# EAGLE design SatNOGSBoard_100mm_80mm (EAGLE 7.2.0)
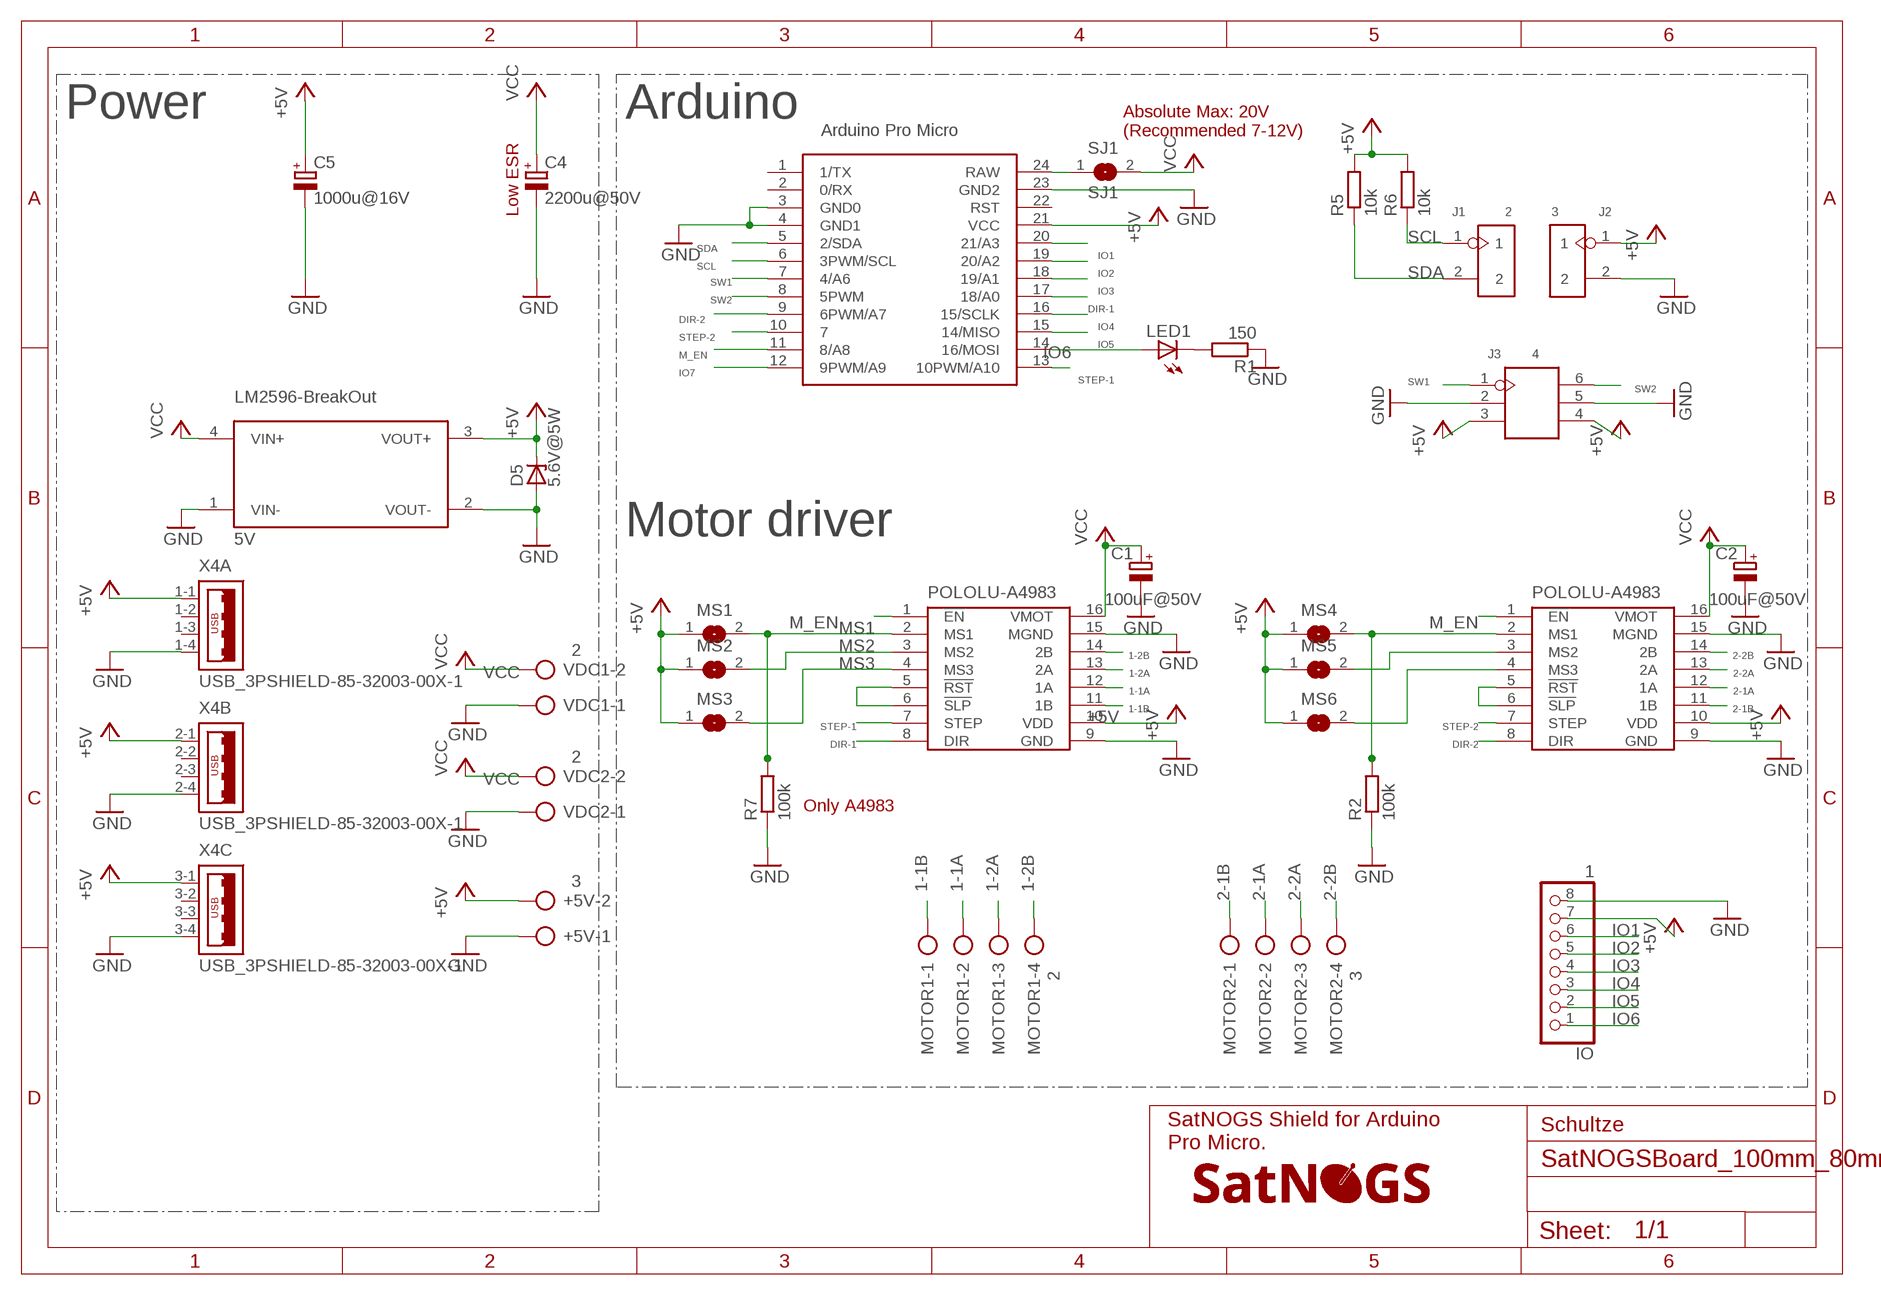
[diagram p0: schematic, sheet 1]

## Parts
+5V  3  AK500/2  [AK500/2]
AZIMUTH  POLOLU-A4983/A4988"  [POLOLU-A4983]
C1  100uF@50V  CPOL-EUE2.5-6  [E2,5-6]
C2  100uF@50V  CPOL-EUE2.5-6  [E2,5-6]
C4  2200u@50V  CPOL-EUE7.5-16  [E7,5-16]
C5  1000u@16V  CPOL-EUE3.5-8  [E3,5-8]
D5  5.6V@5W  ZENER-DIODEDO41Z10  [DO41Z10]
ELEVATION  POLOLU-A4983/A4988"  [POLOLU-A4983]
IO  1  PINHD-1X8  [1X08]
J1  2  HEADER-2P-65/35MIL  [2P-2.54-65/35MIL]
J2  3  HEADER-2P-65/35MIL  [2P-2.54-65/35MIL]
J3  4  HEADER-2X3P-2.54  [2X3P-2.54-65/35MIL]
LED1  LED3MM  [LED3MM]
LM2596  5V  LM2596-BREAKOUTLM2596-BREAKOUT  [LM2596-BREAKOUT]
MOTOR1  2  AK500/4  [AK500/4]
MOTOR2  3  AK500/4  [AK500/4]
MS1  SJ1  SJ  [SJ]
MS2  SJ1  SJ  [SJ]
MS3  SJ1  SJ  [SJ]
MS4  SJ1  SJ  [SJ]
MS5  SJ1  SJ  [SJ]
MS6  SJ1  SJ  [SJ]
R1  150  R-EU_R0805  [R0805]
R2  100k  R-EU_R0805  [R0805]
R5  10k  R-EU_R0805  [R0805]
R6  10k  R-EU_R0805  [R0805]
R7  100k  R-EU_R0805  [R0805]
SJ1  SJ1  SJ  [SJ]
U$1  SATNOGS_LOGOCOPPER_M  [LOGO_COPPER_M]
UC  ARDUINO_PRO_MICROARDUINO_BOARD  [ARDUINO_MICRO_PRO]
VDC1  2  AK500/2  [AK500/2]
VDC2  2  AK500/2  [AK500/2]
X4  USB_3PSHIELD-85-32003-00X-1  [85-32003-00X-1]

## Nets
1-1A [power]: AZIMUTH.12(1A) MOTOR1.2
1-1B [power]: AZIMUTH.11(1B) MOTOR1.1
1-2A [power]: AZIMUTH.13(2A) MOTOR1.3
1-2B [power]: AZIMUTH.14(2B) MOTOR1.4
2-1A [power]: ELEVATION.12(1A) MOTOR2.2
2-1B [power]: ELEVATION.11(1B) MOTOR2.1
2-2A [power]: ELEVATION.13(2A) MOTOR2.3
2-2B [power]: ELEVATION.14(2B) MOTOR2.4
+5V: +5V.2 AZIMUTH.10(VDD) C5.+ D5.C ELEVATION.10(VDD) IO.7 J2.1 J3.3 J3.4 LM2596.3(VOUT+) MS1.1 MS2.1 MS3.1 MS4.1 MS5.1 MS6.1 R5.2 R6.2 UC.21(VCC) X4.1-1 X4.2-1 X4.3-1
DIR-1: AZIMUTH.8(DIR) UC.17(18/A0)
DIR-2: ELEVATION.8(DIR) UC.9(6PWM/A7)
GND: +5V.1 AZIMUTH.9(GND) AZIMUTH.15(MGND) C1.- C2.- C4.- C5.- D5.A ELEVATION.9(GND) ELEVATION.15(MGND) IO.8 J2.2 J3.2 J3.5 LM2596.1(VIN-) LM2596.2(VOUT-) R1.1 R2.1 R7.1 UC.3(GND0) UC.4(GND1) UC.23(GND2) VDC1.1 VDC2.1 X4.1-4 X4.2-4 X4.3-4
IO1: IO.6 UC.20(21/A3)
IO2: IO.5 UC.19(20/A2)
IO3: IO.4 UC.18(19/A1)
IO4: IO.3 UC.16(15/SCLK)
IO5: IO.2 UC.15(14/MISO)
IO6: IO.1 LED1.A UC.14(16/MOSI)
IO7: UC.12(9PWM/A9)
M_EN: AZIMUTH.1(!EN) ELEVATION.1(!EN) UC.11(8/A8)
MS1: AZIMUTH.2(MS1) MS1.2 R7.2
MS2: AZIMUTH.3(MS2) MS2.2
MS3: AZIMUTH.4(MS3) MS3.2
MS4: ELEVATION.2(MS1) MS4.2 R2.2
MS5: ELEVATION.3(MS2) MS5.2
MS6: ELEVATION.4(MS3) MS6.2
N$1: AZIMUTH.5(!RST) AZIMUTH.6(!SLP)
N$2: ELEVATION.5(!RST) ELEVATION.6(!SLP)
N$3: SJ1.1 UC.24(RAW)
N$6: LED1.K(C) R1.2
SCL: J1.1 R6.1 UC.6(3PWM/SCL)
SDA: J1.2 R5.1 UC.5(2/SDA)
STEP-1: AZIMUTH.7(STEP) UC.13(10PWM/A10)
STEP-2: ELEVATION.7(STEP) UC.10
SW1: J3.1 UC.7(4/A6)
SW2: J3.6 UC.8(5PWM)
VCC [power]: AZIMUTH.16(VMOT) C1.+ C2.+ C4.+ ELEVATION.16(VMOT) LM2596.4(VIN+) SJ1.2 VDC1.2 VDC2.2
Unconnected: UC.1(1/TX) UC.2(0/RX) UC.22(RST) X4.1-2 X4.1-3 X4.2-2 X4.2-3 X4.3-2 X4.3-3 X4.M1(S:S1) X4.M2(S:S2) X4.M3(S:S3) X4.M4(S:S4)

## Notes on the sheet
- Power | Arduino
- Absolute Max: 20V
  (Recommended 7-12V)
- Low ESR
- Motor driver
- Only A4983
- Schultze
- SatNOGS Shield for Arduino
  Pro Micro.

## Library data of the parts
+5V VDC1 VDC2 = con-ptr500:AK500/2: CONNECTOR; OC_FARNELL: unknown; OC_NEWARK: unknown
AZIMUTH ELEVATION = satnogs:POLOLU-A4983/A4988: Stepper motor driver https://www.pololu.com/product/1182
C1 C2 C4 C5 = rcl:CPOL-EU: POLARIZED CAPACITOR, European symbol
D5 = diode:ZENER-DIODE: Z-Diode; MPN: 1N5339B
IO = pinhead:PINHD-1X8: PIN HEADER
J1 J2 = Connector:HEADER-2P
J3 = Connector:HEADER-2X3P
LED1 = led:LED: LED OSRAM: - CHIPLED LG R971, LG N971, LY N971, LG Q971, LY Q971, LO R971, LY R971 LH N974, LH R974 LS Q976, LO Q976, LY Q976 LO Q996 - Hyper CHIPLED LW Q18S LB Q993, LB Q99A, LB R99A - SideLED LS A670, LO A670, LY A670, LG A670, LP A670 LB A673, LV A673, LT A673, LW A673 LH A674 LY A675 LS A676, LA A676, LO A676, LY A676, LW A676 LS A679, LY A679, LG A679 - Hyper Micro SIDELED® LS Y876, LA Y876, LO Y876, LY Y876 LT Y87S - SmartLED LW L88C, LW L88S LB L89C, LB L89S, LG L890 LS L89K, LO L89K, LY L89K LS L896, LA L896, LO L896, LY L896 - TOPLED LS T670, LO T670, LY T670, LG T670, LP T670 LSG T670, LSP T670, LSY T670, LOP T670, LYG T670 LG T671, LOG T671, LSG T671 LB T673, LV T673, LT T673, LW T673 LH T674 LS T676, LA T676, LO T676, LY T676, LB T676, LH T676, LSB T676, LW T676 LB T67C, LV T67C, LT T67C, LS T67K, LO T67K, LY T67K, LW E67C LS E67B, LA E67B, LO E67B, LY E67B, LB E67C, LV E67C, LT E67C LW T67C LS T679, LY T679, LG T679 LS T770, LO T770, LY T770, LG T770, LP T770 LB T773, LV T773, LT T773, LW T773 LH T774 LS E675, LA E675, LY E675, LS T675 LS T776, LA T776, LO T776, LY T776, LB T776 LHGB T686 LT T68C, LB T68C - Hyper Mini TOPLED® LB M676 - Mini TOPLED Santana® LG M470 LS M47K, LO M47K, LY M47K Source: http://www.osram.convergy.de LUXEON: - LUMILED® LXK2-PW12-R00, LXK2-PW12-S00, LXK2-PW14-U00, LXK2-PW14-V00 LXK2-PM12-R00, LXK2-PM12-S00, LXK2-PM14-U00 LXK2-PE12-Q00, LXK2-PE12-R00, LXK2-PE12-S00, LXK2-PE14-T00, LXK2-PE14-U00 LXK2-PB12-K00, LXK2-PB12-L00, LXK2-PB12-M00, LXK2-PB14-N00, LXK2-PB14-P00, LXK2-PB14-Q00 LXK2-PR12-L00, LXK2-PR12-M00, LXK2-PR14-Q00, LXK2-PR14-R00 LXK2-PD12-Q00, LXK2-PD12-R00, LXK2-PD12-S00 LXK2-PH12-R00, LXK2-PH12-S00 LXK2-PL12-P00, LXK2-PL12-Q00, LXK2-PL12-R00 Source: www.luxeon.com KINGBRIGHT: KA-3528ASYC Source: www.kingbright.com
LM2596 = satnogs:LM2596-BREAKOUT: Break out for LM2596 Switching power supply (regulated) Footprint approx. 41mmx21mm
MOTOR1 MOTOR2 = con-ptr500:AK500/4: CONNECTOR; OC_FARNELL: unknown; OC_NEWARK: unknown
MS1-MS6 SJ1 = jumper:SJ: SMD solder JUMPER
R1 R2 R5-R7 = rcl:R-EU_: RESISTOR, European symbol
U$1 = satnogs:SATNOGS_LOGO
UC = satnogs:ARDUINO_PRO_MICRO
X4 = con-cypressindustries:USB_3PSHIELD-: Triple USB Connector Source: www.cypressindustries.com; OC_FARNELL: unknown; OC_NEWARK: unknown

## Net classes
0 default: width 0.508 mm, drill 0.813 mm, clearance 0.254 mm
1 power: width 0.813 mm, drill 0.813 mm, clearance 0.254 mm

## Board
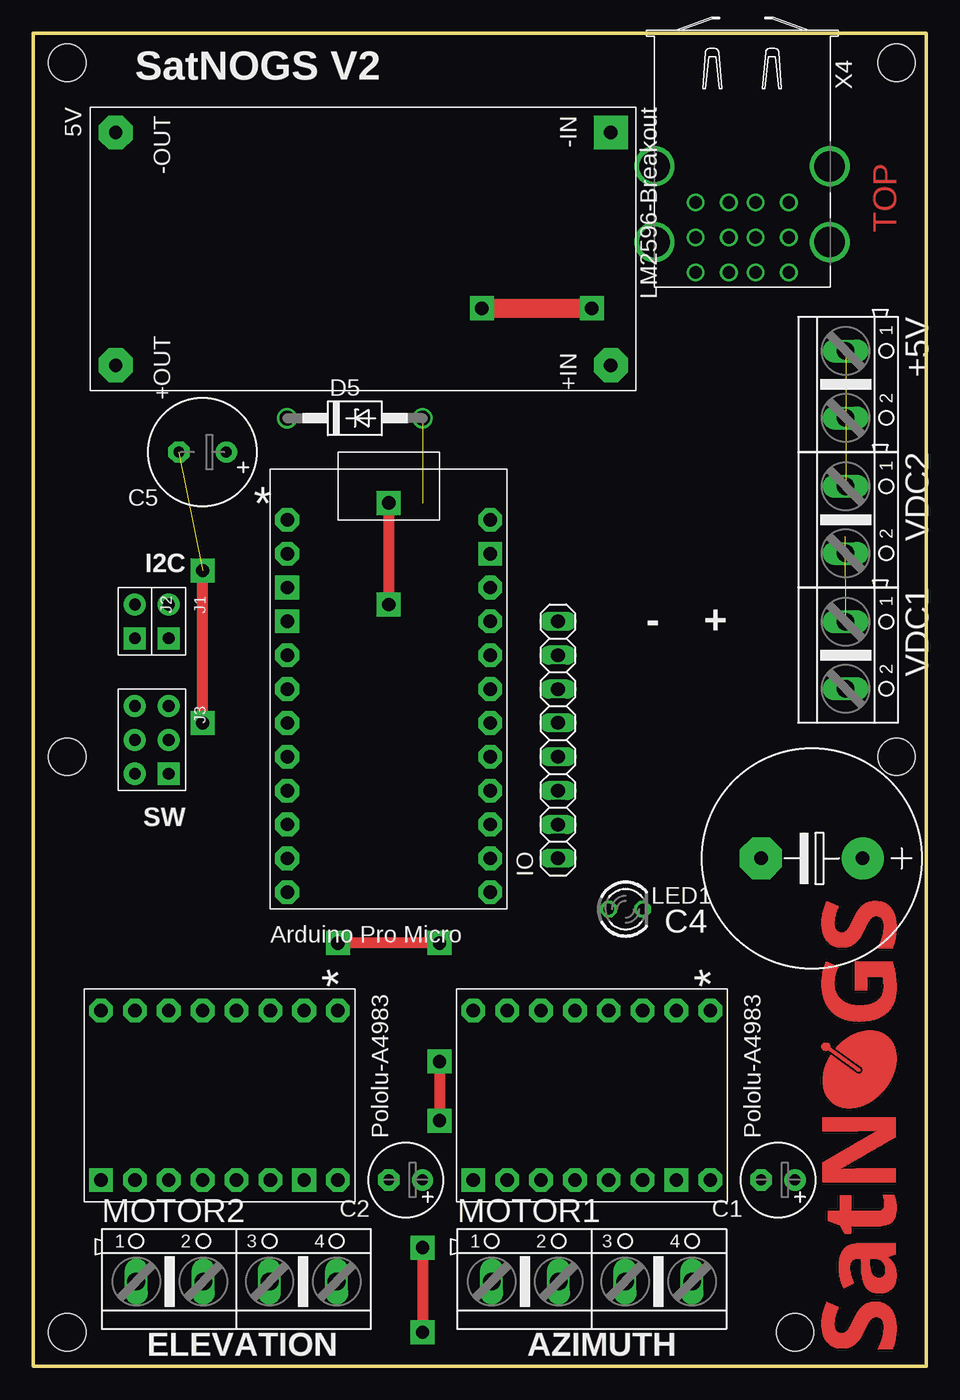
[diagram p1: board, top side]
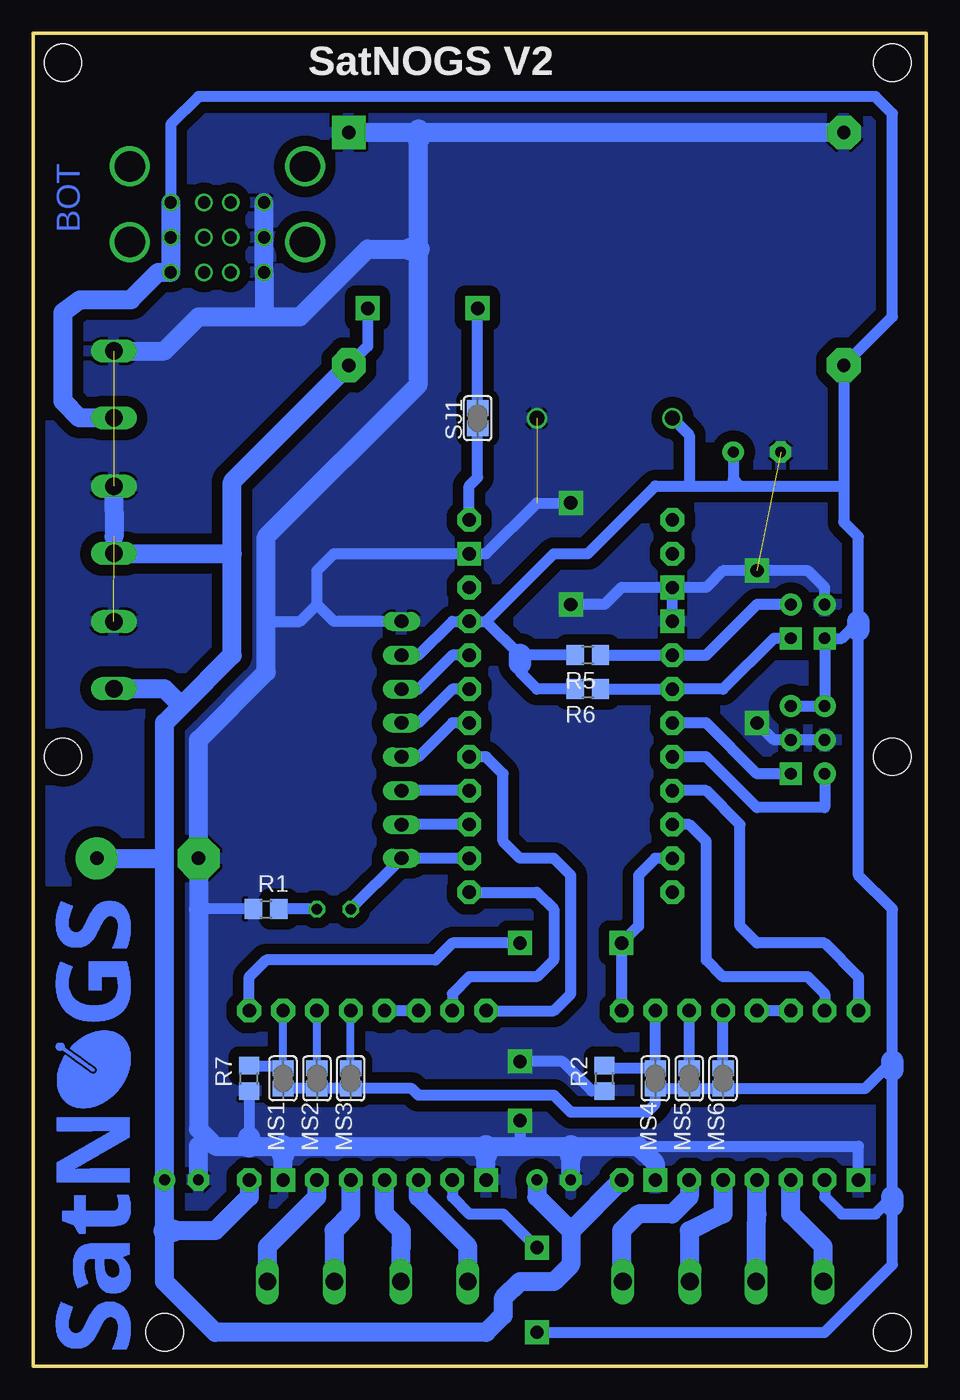
[diagram p2: board, bottom side, seen from below]

Size 67 x 100 mm. Coordinates in mm from the lower left corner, seen from the top.
Outline: 0,0 67,0 67,100 0,100 0,0
Copper layers (1*16): Top 0.035mm / dielectric 1.5mm / Bottom 0.035mm
Design rules "PCB-POOL Standard *": minimum track width 1mil, minimum drill 0.3mm, track to track 0.15mm, track to pad 0.15mm, pad to pad 0.15mm, via to via 0.15mm, smd to smd 0.15mm, copper to edge 0.3mm, drill to drill 0.2mm, minimum pad ring 0.2mm, minimum via ring 0.15mm, stop-mask expansion 0.075mm, vias tented up to drill 0mil, thermal gap 0.2mm
Holes 2.8 mm at 2.54,97.79 64.77,97.79 2.54,2.54 57.15,2.54 2.54,45.72 64.77,45.72

### Footprints (pad centres in the part's own frame; a part is rotated, then mirrored left to right if it is on the bottom)
AK500/2 = drill 1.321 long: 1 -2.515,0; 2 2.515,0
POLOLU-A4983 = drill 1 pad 1.778 octagon: 1 -6.35,8.89; 2 -6.35,6.35; 3 -6.35,3.81; 4 -6.35,1.27; 5 -6.35,-1.27; 6 -6.35,-3.81; 7 -6.35,-6.35; 8 -6.35,-8.89; 10 6.35,-6.35; 11 6.35,-3.81; 12 6.35,-1.27; 13 6.35,1.27; 14 6.35,3.81; 16 6.35,8.89 | drill 1 pad 1.778 square: 9 6.35,-8.89; 15 6.35,6.35
E2,5-6 = drill 0.813 pad 1.6: + -1.27,0 | drill 0.813 pad 1.6 octagon: - 1.27,0
E7,5-16 = drill 1.016 pad 3.15: + -3.81,0 | drill 1.016 pad 3.15 octagon: - 3.81,0
E3,5-8 = drill 0.813 pad 1.6: + -1.778,0 | drill 0.813 pad 1.6 octagon: - 1.778,0
DO41Z10 = drill 1.118: A 5.08,0; C -5.08,0
1X08 = drill 1.016 long: 1 -8.89,0; 2 -6.35,0; 3 -3.81,0; 4 -1.27,0; 5 1.27,0; 6 3.81,0; 7 6.35,0; 8 8.89,0
2P-2.54-65/35MIL = drill 0.889 pad 1.651 square: 1 0,1.27 | drill 0.889 pad 1.651: 2 0,-1.27
2X3P-2.54-65/35MIL = drill 0.889 pad 1.651 square: 1 -1.27,2.54 | drill 0.889 pad 1.651: 2 -1.27,0; 3 -1.27,-2.54; 4 1.27,-2.54; 5 1.27,0; 6 1.27,2.54
LED3MM = drill 0.813 octagon: A -1.27,0; K 1.27,0
LM2596-BREAKOUT = drill 1 pad 2.54 square: 1 -8.89,17.78 | drill 1 pad 2.54 octagon: 2 -8.89,-19.367; 3 8.572,-19.367; 4 8.572,17.78
AK500/4 = drill 1.321 long: 1 -7.518,0; 2 -2.489,0; 3 2.489,0; 4 7.518,0
SJ = smd 1.168 x 1.6: 1 -0.762,0; 2 0.762,0
R0805 = smd 1.3 x 1.5: 1 -0.95,0; 2 0.95,0
ARDUINO_MICRO_PRO = drill 1 pad 1.778 octagon: 1 -7.62,12.7; 2 -7.62,10.16; 5 -7.62,2.54; 6 -7.62,0; 7 -7.62,-2.54; 8 -7.62,-5.08; 9 -7.62,-7.62; 10 -7.62,-10.16; 11 -7.62,-12.7; 12 -7.62,-15.24; 13 7.62,-15.24; 14 7.62,-12.7; 15 7.62,-10.16; 16 7.62,-7.62; 17 7.62,-5.08; 18 7.62,-2.54; 19 7.62,0; 20 7.62,2.54; 21 7.62,5.08; 22 7.62,7.62; 24 7.62,12.7 | drill 1 pad 1.778 square: 3 -7.62,7.62; 4 -7.62,5.08; 23 7.62,10.16
85-32003-00X-1 = drill 0.92 pad 1.27: 1-1 2.71,3.5; 1-2 2.71,1; 1-3 2.71,-1; 1-4 2.71,-3.5; 2-1 5.33,3.5; 2-2 5.33,1; 2-3 5.33,-1; 2-4 5.33,-3.5; 3-1 7.95,3.5; 3-2 7.95,1; 3-3 7.95,-1; 3-4 7.95,-3.5 | drill 2.3 pad 3: M1 0,6.57; M2 0,-6.57; M3 5.68,6.57; M4 5.68,-6.57

### Placement (x,y rotation side)
+5V  60.96,73.66 270 top
AZIMUTH  41.91,20.32 270 top
C1  55.88,13.97 180 top
C2  27.94,13.97 180 top
C4  58.42,38.1 180 top
C5  12.7,68.58 180 top
D5  24.13,71.12 0 top
ELEVATION  13.97,20.32 270 top
IO  39.37,46.99 90 top
J1  10.16,55.88 180 top
J2  7.62,55.88 180 top
J3  8.89,46.99 180 top
LED1  44.45,34.29 0 top
LM2596  25.55,83.67 270 top
MOTOR1  41.91,6.35 0 top
MOTOR2  15.24,6.35 0 top
MS1  48.26,21.59 90 bottom
MS2  45.72,21.59 90 bottom
MS3  43.18,21.59 90 bottom
MS4  20.32,21.59 90 bottom
MS5  17.78,21.59 90 bottom
MS6  15.24,21.59 90 bottom
R1  49.53,34.29 0 bottom
R2  24.13,21.59 90 bottom
R5  25.4,53.34 180 bottom
R6  25.4,50.8 180 bottom
R7  50.8,21.59 90 bottom
SJ1  33.66,71.12 90 bottom
U$1  64.77,1.27 90 top
U$2  SATNOGS_LOGOCOPPER_M  [LOGO_COPPER_M]  59.69,1.27 90 bottom
UC  26.67,50.8 0 top
VDC1  60.96,53.34 270 top
VDC2  60.96,63.5 270 top
X4  53.19,90.02 270 top

### Tracks (layer width: path | path; a pad name or v marks a point on that pad's centre or on a via)
1-1A
  Bottom 1.422: MOTOR1.2 39.42,8.84 39.37,8.89 39.37,10.16 40.64,11.43 AZIMUTH.12
1-1B
  Bottom 1.422: MOTOR1.1 34.39,8.99 38.1,12.7 AZIMUTH.11
1-2A
  Bottom 1.422: AZIMUTH.13 43.18,11.43 44.45,10.16 44.45,6.4 MOTOR1.3
1-2B
  Bottom 1.422: MOTOR1.4 49.43,8.99 45.72,12.7 AZIMUTH.14
2-1A
  Bottom 1.422: MOTOR2.2 12.75,10.21 12.7,11.43 ELEVATION.12
2-1B
  Bottom 1.422: MOTOR2.1 7.72,8.99 10.16,11.43 ELEVATION.11
2-2A
  Bottom 1.422: ELEVATION.13 15.24,11.43 17.78,10.16 17.78,6.4 MOTOR2.3
2-2B
  Bottom 1.422: MOTOR2.4 22.86,6.45 22.86,10.16 21.59,11.43 19.05,11.43 17.78,12.7 ELEVATION.14
+5V  (via drill 1)
  Top 0.813: v29.21,8.89 v29.21,2.54
  Bottom 0.813: IO.7 38.1,53.34 35.56,55.88 UC.21 33.02,55.88 | MS1.1 MS2.1 MS3.1 38.61,20.83 38.1,20.32 27.94,20.32 26.67,19.05 20.95,19.05 20.32,19.68 MS4.1 MS5.1 MS6.1 4.57,20.83 2.54,22.86 2.54,34.29 5.08,36.83 5.08,55.24 | J3.3 J3.4 J2.1 6.35,54.61 5.08,55.88 5.08,62.23 6.18,63.33 6.18,66.04 | ELEVATION.10 7.62,12.7 6.35,11.43 3.81,11.43 2.54,12.7 2.54,22.23 | AZIMUTH.10 35.56,12.7 34.29,11.43 31.75,11.43 v29.21,8.89 | v29.21,2.54 7.62,2.54 2.54,7.62 2.54,12.06 | X4.1-1 56.69,93.17 54.61,95.25 3.81,95.25 2.54,93.98 2.54,78.74 LM2596.3 6.18,66.04 | R5.2 30.48,53.34 33.02,55.88 | 30.48,52.7 30.48,52.07 29.21,50.8 R6.2 26.67,51.12 | 33.02,55.88 27.94,60.96 25.4,60.96 20.32,66.04 17.78,66.04 | 17.78,66.04 13.97,66.04 | 13.97,66.04 6.18,66.04 | C5.+ 14.48,66.55 13.97,66.04 | D5.C 17.78,69.85 17.78,66.04
  Bottom 1.422: X4.1-1 X4.2-1 X4.3-1 57.63,82.07 59.69,80.01 63.5,80.01 64.77,79.07 64.77,72.39 63.52,71.14 +5V.2
  Bottom 1.676: 30.48,53.34 30.48,52.7 | 5.08,55.88 5.08,55.24 | 2.54,22.86 2.54,22.23 | 2.54,12.7 2.54,12.06
DIR-1
  Bottom 0.813: AZIMUTH.8 27.94,26.67 26.67,27.94 26.67,36.83 27.94,38.1 30.48,38.1 31.75,39.37 31.75,44.45 33.02,45.72 UC.17
DIR-2
  Bottom 0.813: ELEVATION.8 5.08,29.21 7.62,31.75 12.7,31.75 13.97,33.02 13.97,40.64 16.51,43.18 UC.9
GND  (via drill 1, 1 pad 1.78)  (4 unrouted)
  Top 0.813: v26.67,64.77 v26.67,57.15 | v30.48,22.86 v30.48,18.41 | v12.7,48.26 v12.7,59.69
  Bottom 0.813: UC.4 UC.3 | ELEVATION.9 5.08,16.51 26.67,16.51 | v26.67,64.77 29.21,64.77 33.02,60.96 UC.23 44.45,60.96 45.72,59.69 45.72,57.15 | v26.67,57.15 24.13,57.15 22.86,58.42 UC.3 | UC.3 16.51,58.42 15.24,59.69 v12.7,59.69 8.89,59.69 7.62,58.42 J2.2 | J3.2 J3.5 11.43,46.99 v12.7,48.26 | IO.8 44.45,55.88 45.72,57.15 | 49.53,55.88 46.99,55.88 45.72,57.15 | R7.1 50.8,17.14 | v30.48,18.41 30.48,16.51 | R2.1 25.09,20.64 27.3,22.86 v30.48,22.86 | R1.1 54.61,34.29
  Bottom 1.422: 53.98,17.14 54.61,17.78 54.61,34.29 C4.- 54.61,46.99 49.53,52.07 49.53,55.88 49.53,62.23 38.1,73.66 38.1,83.82 38.1,92.08 38.1,92.56 | 53.98,17.14 53.34,16.51 50.8,16.51 48.26,16.51 33.02,16.51 30.48,16.51 26.67,16.51 21.59,16.51 20.32,15.24 ELEVATION.15 | C1.- 54.61,16.51 53.98,17.14 | C2.- 26.67,15.88 | AZIMUTH.9 33.02,15.88 | AZIMUTH.15 48.26,15.88 | +5V.1 57.17,76.17 54.61,78.74 49.53,78.74 | X4.1-4 X4.2-4 X4.3-4 49.69,78.9 49.53,78.74 | VDC2.1 60.94,62.23 | LM2596.2 38.1,92.56 | 38.1,92.56 LM2596.1 | 49.53,78.74 46.99,78.74 41.91,83.82 38.73,83.82
  Bottom 1.676: 48.26,16.51 48.26,15.88 | 33.02,16.51 33.02,15.88 | 26.67,16.51 26.67,15.88 | 38.1,92.71 38.1,92.08 | 38.1,83.82 38.73,83.82 | 50.8,16.51 50.8,17.14
  pour Bottom (isolate 0.813): 0,100.33 0,0 67.31,0 67.31,100.33
IO1
  Bottom 0.813: UC.20 35.56,53.34 38.1,50.8 IO.6
IO2
  Bottom 0.813: UC.19 35.56,50.8 38.1,48.26 IO.5
IO3
  Bottom 0.813: UC.18 35.56,48.26 38.1,45.72 IO.4
IO4
  Bottom 0.813: UC.16 IO.3
IO5
  Bottom 0.813: UC.15 IO.2
IO6
  Bottom 0.813: UC.14 IO.1 LED1.A
M_EN  (via drill 1 pad 1.78)
  Top 0.813: v30.48,31.75 v22.86,31.75
  Bottom 0.813: ELEVATION.1 v22.86,31.75 21.59,33.02 21.59,36.83 20.32,38.1 UC.11 | AZIMUTH.1 50.8,29.21 49.53,30.48 36.83,30.48 35.56,31.75 v30.48,31.75
MS1
  Bottom 0.61: AZIMUTH.2 MS1.2 48.45,22.54
  Bottom 0.813: R7.2 48.45,22.54
MS2
  Bottom 0.61: MS2.2 AZIMUTH.3
MS3
  Bottom 0.61: MS3.2 AZIMUTH.4
MS4
  Bottom 0.813: ELEVATION.2 MS4.2 23.94,22.35 R2.2
MS5
  Bottom 0.813: MS5.2 ELEVATION.3
MS6
  Bottom 0.813: MS6.2 ELEVATION.4
N$1
  Bottom 0.813: AZIMUTH.6 AZIMUTH.5
N$2
  Bottom 0.813: ELEVATION.6 ELEVATION.5
N$3
  Bottom 0.813: UC.24 34.29,66.04 33.66,66.67 SJ1.1
N$6
  Bottom 0.813: LED1.K R1.2
SCL
  Bottom 0.813: J1.1 11.43,54.61 15.24,50.8 UC.6 R6.1
SDA
  Bottom 0.813: J1.2 12.7,57.15 16.51,53.34 UC.5 R5.1
STEP-1
  Bottom 0.813: AZIMUTH.7 35.56,27.94 34.29,29.21 29.21,29.21 27.94,30.48 27.94,34.29 29.21,35.56 UC.13
STEP-2
  Bottom 0.813: UC.10 17.78,40.64 16.51,39.37 16.51,30.48 15.24,29.21 8.89,29.21 7.62,27.94 ELEVATION.7
SW1
  Bottom 0.813: J3.1 12.7,44.45 16.51,48.26 UC.7
SW2
  Bottom 0.813: J3.6 7.62,41.91 12.7,41.91 16.51,45.72 UC.8
VCC  (via drill 1)
  Top 1.422: v33.66,79.38 v41.91,79.38
  Bottom 0.813: SJ1.2 v33.66,79.38 | v41.91,79.38 41.91,76.52 LM2596.4
  Bottom 1.422: ELEVATION.16 26.67,10.16 | C2.+ 29.21,12.7 26.67,10.16 | 57.15,38.1 C1.+ 57.15,10.16 57.15,6.35 53.34,2.54 33.02,2.54 31.75,3.81 31.75,5.08 30.48,6.35 27.94,6.35 26.67,7.62 26.67,10.16 | 57.15,38.1 57.15,48.26 55.88,49.53 | 43.5,74.93 LM2596.4 52.07,66.36 52.07,60.96 | AZIMUTH.16 50.8,12.7 53.34,10.16 56.52,10.16 | 55.88,49.53 52.07,53.34 52.07,60.96 | C4.+ 57.15,38.1 | VDC2.2 52.09,60.98 52.07,60.96 | VDC1.2 57.17,50.83 55.88,49.53
  Bottom 1.676: 57.15,10.16 56.52,10.16

### Text on the board
Top: TOP
Bottom: BOT
tPlace: SatNOGS V2 | I2C | - | + | SW | ELEVATION | AZIMUTH
bPlace: SatNOGS V2
Reference: Eagle Freeware: 100x80mm | Euro: 160x100mm